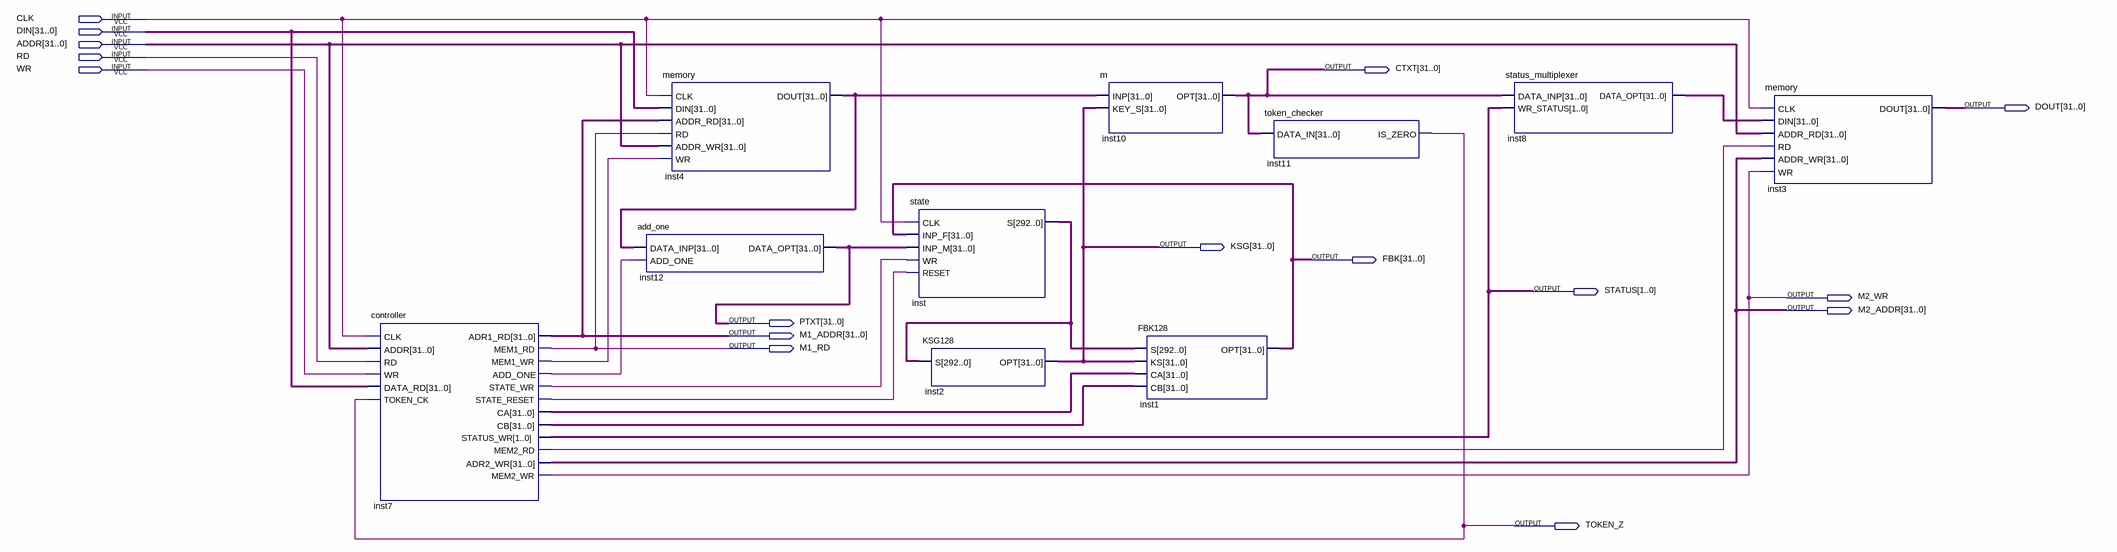
[diagram p0: schematic sheet]
// Quartus schematic acorn_coprocesor.bdf as structural Verilog: 10 symbols, 16 pins
module acorn_coprocesor (
  input  CLK,
  input  [31:0] DIN,
  input  [31:0] ADDR,
  input  RD,
  input  WR,
  output [31:0] CTXT,
  output [31:0] DOUT,
  output [31:0] KSG,
  output [31:0] FBK,
  output [1:0] STATUS,
  output M2_WR,
  output [31:0] M2_ADDR,
  output [31:0] PTXT,
  output [31:0] M1_ADDR,
  output M1_RD,
  output TOKEN_Z
);

  wire inst7_add_one, inst7_mem1_wr, inst7_mem2_rd, inst7_state_reset, inst7_state_wr;
  wire [31:0] inst4_dout, inst7_ca, inst7_cb, inst8_data_opt;
  wire [292:0] inst_s;

  controller inst7 (
    .CLK(CLK), .ADDR(ADDR), .RD(RD), .WR(WR), .DATA_RD(DIN), .TOKEN_CK(TOKEN_Z), .ADR1_RD(M1_ADDR),
    .MEM1_RD(M1_RD), .MEM1_WR(inst7_mem1_wr), .ADD_ONE(inst7_add_one), .STATE_WR(inst7_state_wr),
    .STATE_RESET(inst7_state_reset), .CA(inst7_ca), .CB(inst7_cb), .STATUS_WR(STATUS),
    .MEM2_RD(inst7_mem2_rd), .ADR2_WR(M2_ADDR), .MEM2_WR(M2_WR));
  add_one inst12 (.DATA_INP(inst4_dout), .ADD_ONE(inst7_add_one), .DATA_OPT(PTXT));
  memory inst4 (
    .CLK(CLK), .DIN(DIN), .ADDR_RD(M1_ADDR), .RD(M1_RD), .ADDR_WR(ADDR), .WR(inst7_mem1_wr), .DOUT(inst4_dout));
  state inst (.CLK(CLK), .INP_F(FBK), .INP_M(PTXT), .WR(inst7_state_wr), .RESET(inst7_state_reset), .S(inst_s));
  KSG128 inst2 (.S(inst_s), .OPT(KSG));
  m inst10 (.INP(inst4_dout), .KEY_S(KSG), .OPT(CTXT));
  FBK128 inst1 (.S(inst_s), .KS(KSG), .CA(inst7_ca), .CB(inst7_cb), .OPT(FBK));
  token_checker inst11 (.DATA_IN(CTXT), .IS_ZERO(TOKEN_Z));
  status_multiplexer inst8 (.DATA_INP(CTXT), .WR_STATUS(STATUS), .DATA_OPT(inst8_data_opt));
  memory inst3 (
    .CLK(CLK), .DIN(inst8_data_opt), .ADDR_RD(ADDR), .RD(inst7_mem2_rd), .ADDR_WR(M2_ADDR), .WR(M2_WR),
    .DOUT(DOUT));
endmodule
